# Altium schematic sheet SB_PSU.SchDoc
size A4
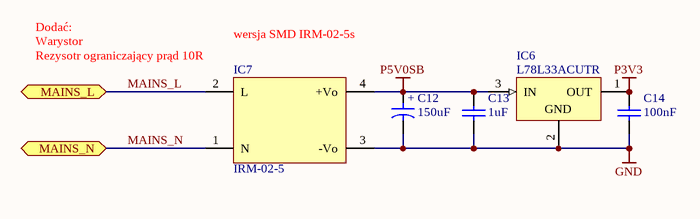
[diagram p0: SB_PSU.SchDoc]

## Parts
C12  150uF  [CAPPR500-1050X800]
C13  1uF  [CAPC1608X87N]
C14  100nF  [CAPC1608X87N]
IC6  L78L33ACUTR  [SOT89]
IC7  IRM-02-5  [PWS_MEANWELL_IRM-02]

## Ports
MAINS_L (bidir), MAINS_N (bidir)

## Nets
GND: C12.2 C13.1 C14.2 IC6.2(GND) IC7.3(-Vo)
P3V3: C14.1 IC6.1(OUT)
P5V0SB: C12.1 C13.2 IC6.3(IN) IC7.4(+Vo)
MAINS_L: IC7.2(L) ; port MAINS_L
MAINS_N: IC7.1(N) ; port MAINS_N

## Notes on the sheet
- Dodać:
- Warystor
- (near IC7) Rezysotr ograniczający prąd 10R
- wersja SMD IRM-02-5s
- (in symbol CAER_150UF_16V_20%_SANYO_16SEQP150M) +

## Library data of the parts
C12 = CAER_150UF_16V_20%_SANYO_16SEQP150M: Polarised capacitor; Part Description: Aluminium Solid Capacitor with Conductive Polymer (SEQP Series); Manufacturer: SANYO OS-CON; Voltage: 16V; Tolerance: ±20%; Part Number: CAER_150UF_16V_20%_SANYO_16SEQP150M; Component Kind: Standard; Component Type: Standard; Pin Count: 2; Value: 150uF; Status: Not Recommended; Manufacturer Part Number: 16SEQP150M; Case: LS5 D10 x H8; Mounted: Yes; Socket: No; SMD: No; Sense: No; ComponentHeight: 8mm; HelpURL: \\cern.ch\dfs\Applications\Altium\Datasheets\CAER_SANYO_SEQP.pdf; Author: CERN DEM JLC; CreateDate: 07.03.2011; LatestRevisionDate: 07.03.2011
C13 = CC0603_1UF_16V_10%_X7R: Non-polarised capacitor; Part Description: SMD Multilayer Chip Ceramic Capacitor; Manufacturer: GENERIC; Manufacturer1 Part Number: 223878615663; Voltage: 16V; TC: X7R; Tolerance: ±10%; Part Number: CC0603_1UF_16V_10%_X7R; Component Kind: Standard; Component Type: Standard; Pin Count: 2; Value: 1uF; Status: None; Manufacturer Part Number: CC0603_1UF_16V_10%_X7R; Case: 0603; Mounted: Yes; Socket: No; SMD: Yes; Manufacturer1 Example: YAGEO PHYCOMP; Manufacturer1 ComponentHeight: 0.9mm; HelpURL: \\cern.ch\dfs\Applications\Altium\Datasheets\CC0603_X7R_PHYCOMP.pdf; Author: CERN DEM JLC; CreateDate: 03.12.2007; LatestRevisionDate: 17.04.2015; Sense: No
C14 = CC0603_100NF_50V_10%_X5R: Non-polarised capacitor; Part Description: SMD Multilayer Chip Ceramic Capacitor; Manufacturer: GENERIC; Manufacturer1 Part Number: C1608X5R1H104K080; Voltage: 50V; TC: X5R; Tolerance: ±10%; Part Number: CC0603_100NF_50V_10%_X5R; Component Kind: Standard; Component Type: Standard; Pin Count: 2; Value: 100nF; Status: None; Manufacturer Part Number: CC0603_100NF_50V_10%_X5R; Case: 0603; Mounted: Yes; Socket: No; SMD: Yes; Sense: No; Manufacturer1 Example: TDK; Manufacturer1 ComponentHeight: 0.9mm; HelpURL: \\cern.ch\dfs\Applications\Altium\Datasheets\CC0603_X5R_TDK_C.pdf; Author: CERN DEM MR; CreateDate: 08.01.2016; LatestRevisionDate: 08.01.2016
IC6 = L78L33ACUTR: 3-Terminal Regulator 1=OUT 2=GND 3=IN; Part Description: 33V 100mA Positive Voltage Regulator; Manufacturer: ST MICROELECTRONICS; PressFit: No; Bonding: No; Part Number: L78L33ACUTR; Component Kind: Standard; Component Type: Standard; Device: L78L33ACUTR; PackageDescription: SOT89-3, 3-Leads, Body 2.44x4.5mm; Manufacturer Part Number: L78L33ACUTR; Pin Count: 4; Case: SOT89; Mounted: Yes; Socket: No; SMD: Yes; Sense: No; ComponentHeight: 1.6mm; HelpURL: \\cern.ch\dfs\Applications\Altium\Datasheets\L78L33ACUTR.pdf; Author: CERN DEM JLC; CreateDate: 12.05.2014; LatestRevisionDate: 12.05.2014
IC7 = AC_DC_IRM-02-5: Power Supply; Part Description: 85-305VAC to 5VDC (400mA) 2W Power Supply; Manufacturer: MEAN WELL; PressFit: No; Bonding: No; Part Number: IRM-02-5; Component Kind: Standard; Component Type: Standard; Device: IRM-02-5; PackageDescription: IRM-02 Series, Body 33.7x22.2mm, Power Supply; Status: None; Manufacturer Part Number: IRM-02-5; Pin Count: 4; Mounted: Yes; Socket: No; SMD: No; Sense: No; ComponentHeight: 15mm; HelpURL: \\cern.ch\dfs\Applications\Altium\Datasheets\IRM-02-24.pdf; Author: GK; CreateDate: 14.02.2018; LatestRevisionDate: 14.02.2018